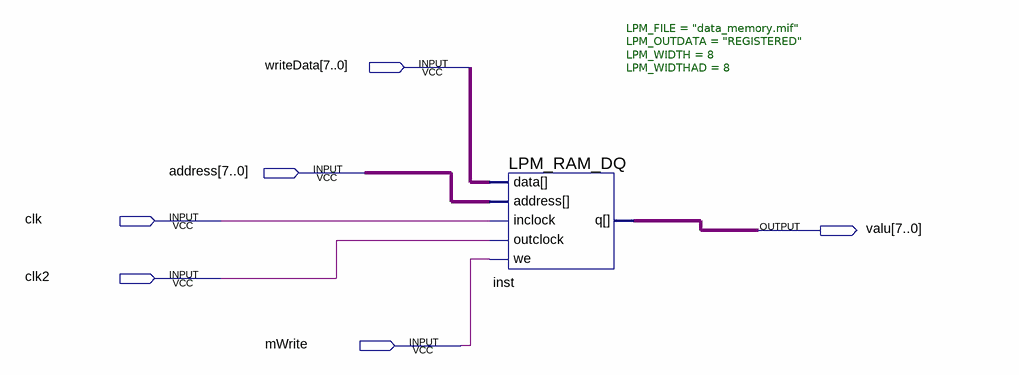
[diagram p0: schematic sheet]
// Quartus schematic dataMem.bdf as structural Verilog: 1 symbols, 6 pins
module dataMem (
  input  [7:0] writeData,
  input  [7:0] address,
  input  clk,
  input  clk2,
  input  mWrite,
  output [7:0] valu
);

  LPM_RAM_DQ #(.LPM_FILE("data_memory.mif"), .LPM_OUTDATA("REGISTERED"), .LPM_WIDTH(8), .LPM_WIDTHAD(8)) inst (
    .inclock(clk), .data(writeData), .address(address), .we(mWrite), .outclock(clk2), .q(valu));
endmodule
